# Altium schematic sheet DCTCXO.SchDoc: DCTCXO
size B; SheetNumber: 7; SheetTotal: 8
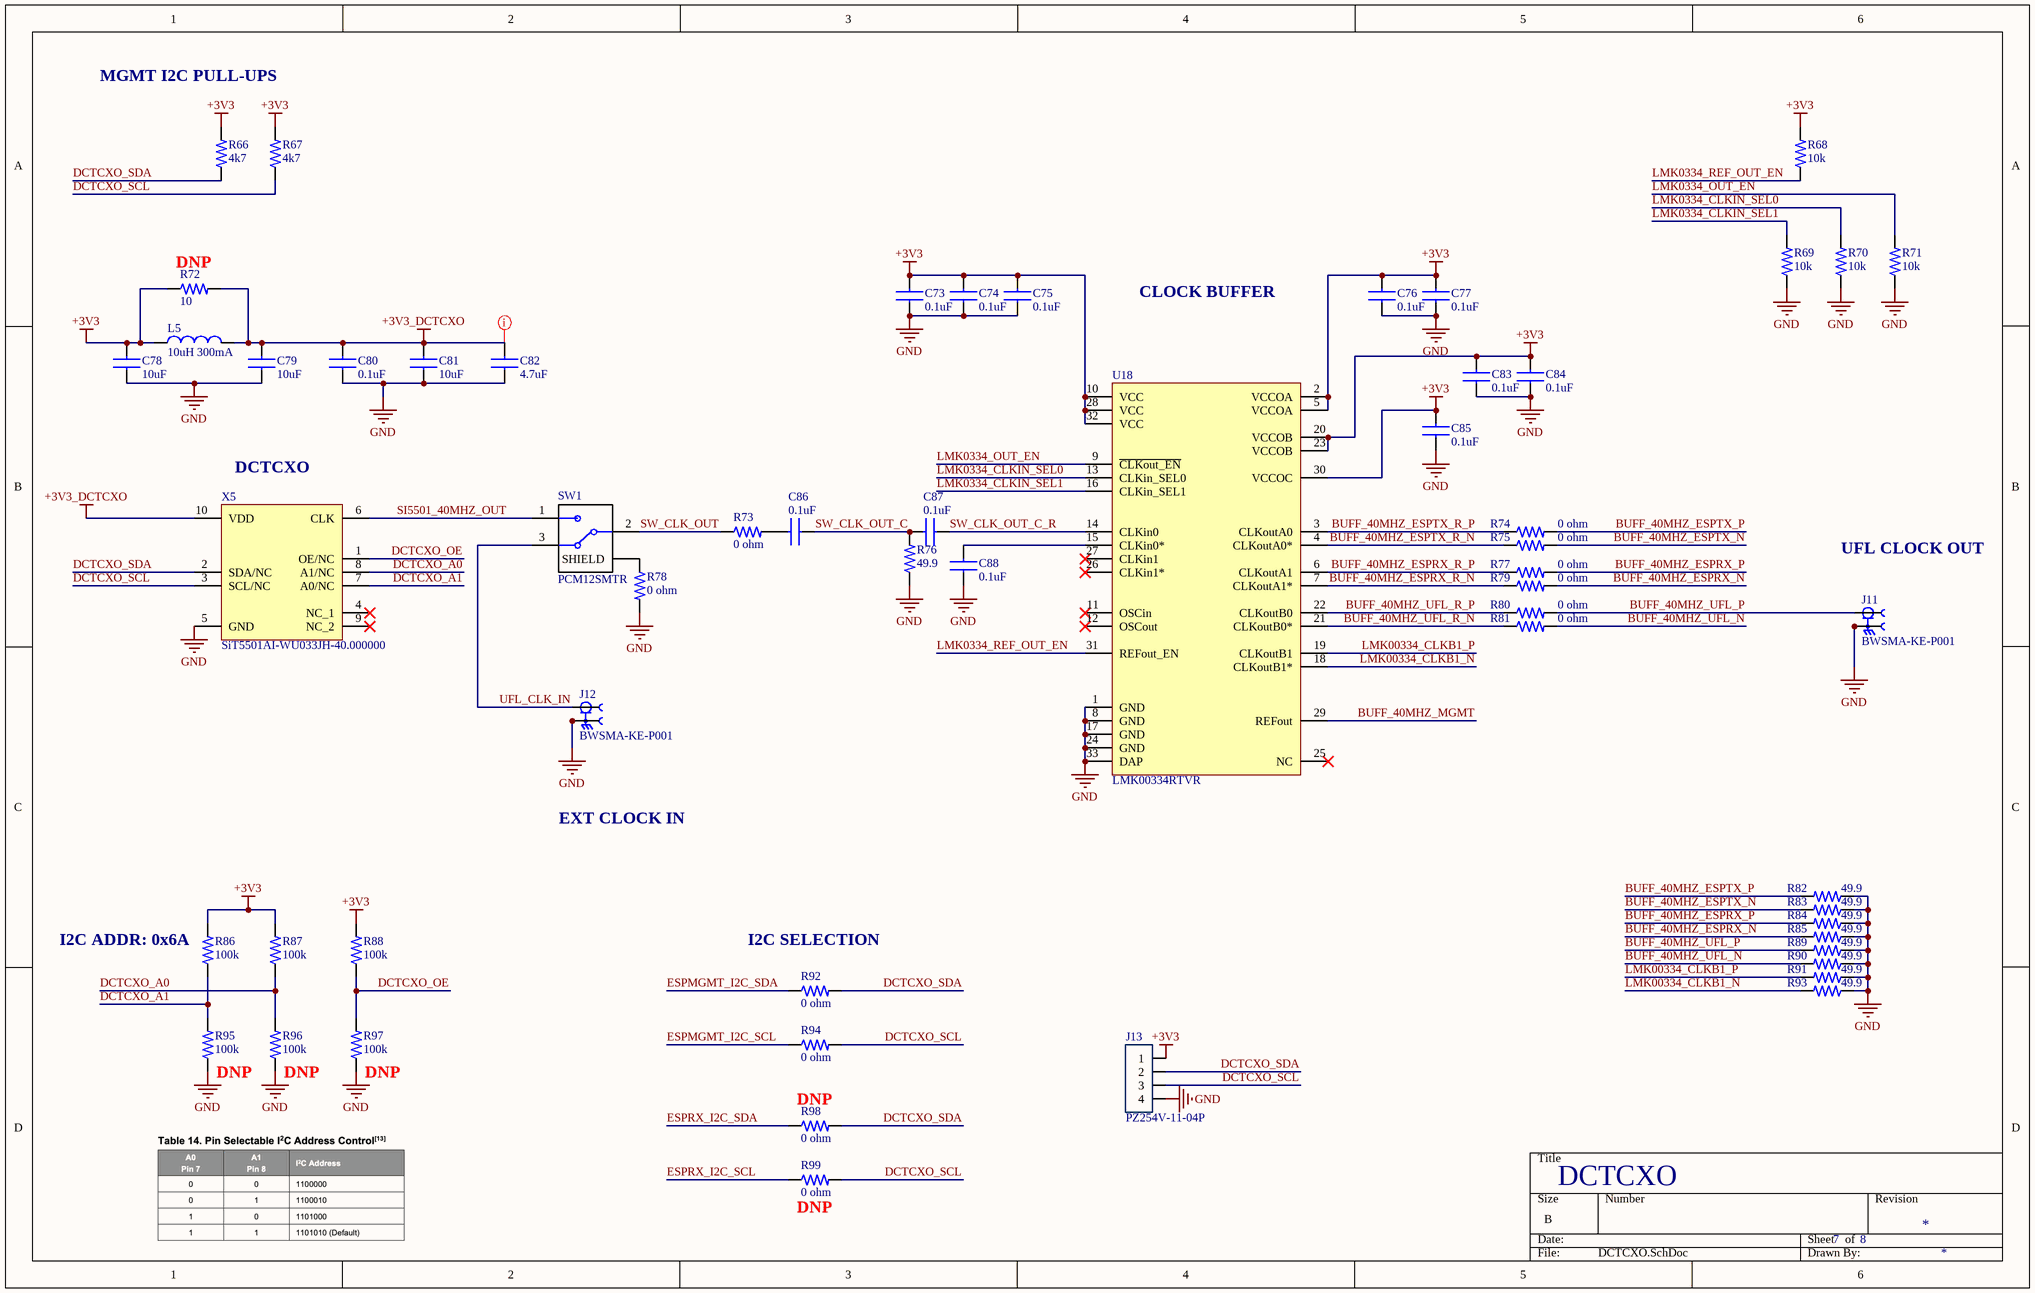
[diagram p0: DCTCXO.SchDoc]

## Parts
C73  0.1uF  [CAP_0402]
C74  0.1uF  [CAP_0402]
C75  0.1uF  [CAP_0402]
C76  0.1uF  [CAP_0402]
C77  0.1uF  [CAP_0402]
C78  10uF  [CAP_0402]
C79  10uF  [CAP_0402]
C80  0.1uF  [CAP_0402]
C81  10uF  [CAP_0402]
C82  4.7uF  [CAP_0402]
C83  0.1uF  [CAP_0402]
C84  0.1uF  [CAP_0402]
C85  0.1uF  [CAP_0402]
C86  0.1uF  [CAP_0402]
C87  0.1uF  [CAP_0402]
C88  0.1uF  [CAP_0402]
J11  BWSMA-KE-P001  [CONN_BWSMA-KE-P001]
J12  BWSMA-KE-P001  [CONN_BWSMA-KE-P001]
J13  PZ254V-11-04P  [CONN_4_PIN_M_100MIL]
L5  10uH 300mA  [L_490-LQM18DN100M70LCT-ND]
R66  4k7  [RES_0402]
R67  4k7  [RES_0402]
R68  10k  [RES_0402]
R69  10k  [RES_0402]
R70  10k  [RES_0402]
R71  10k  [RES_0402]
R72  10  [RES_0402]  (no BOM)
R73  0 ohm  [RES_0402]
R74  0 ohm  [RES_0402]
R75  0 ohm  [RES_0402]
R76  49.9  [RES_0402]
R77  0 ohm  [RES_0402]
R78  0 ohm  [RES_0402]
R79  0 ohm  [RES_0402]
R80  0 ohm  [RES_0402]
R81  0 ohm  [RES_0402]
R82  49.9  [RES_0402]
R83  49.9  [RES_0402]
R84  49.9  [RES_0402]
R85  49.9  [RES_0402]
R86  100k  [RES_0402]
R87  100k  [RES_0402]
R88  100k  [RES_0402]
R89  49.9  [RES_0402]
R90  49.9  [RES_0402]
R91  49.9  [RES_0402]
R92  0 ohm  [RES_0402]
R93  49.9  [RES_0402]
R94  0 ohm  [RES_0402]
R95  100k  [RES_0402]  (no BOM)
R96  100k  [RES_0402]  (no BOM)
R97  100k  [RES_0402]  (no BOM)
R98  0 ohm  [RES_0402]  (no BOM)
R99  0 ohm  [RES_0402]  (no BOM)
SW1  PCM12SMTR  [SW_PCM12SMTR]
U18  LMK00334RTVR  [IC_LMK00334RTVR]
X5  SiT5501AI-WU033JH-40.000000  [XTAL_SiT5501_70x50]

## Nets
+3V3: C73.2 C74.2 C75.2 C76.2 C77.2 C78.2 C83.2 C84.2 C85.2 J13.1 L5.1 R66.2 R67.2 R68.2 R72.1 R86.2 R87.2 R88.2 U18.2(VCCOA) U18.5(VCCOA) U18.10(VCC) U18.20(VCCOB) U18.23(VCCOB) U18.28(VCC) U18.30(VCCOC) U18.32(VCC)
+3V3_DCTCXO: C79.2 C80.2 C81.2 C82.2 L5.2 R72.2 X5.10(VDD)
GND: C73.1 C74.1 C75.1 C76.1 C77.1 C78.1 C79.1 C80.1 C81.1 C82.1 C83.1 C84.1 C85.1 C88.2 J11.2 J11.3 J11.4 J11.5 J12.2 J12.3 J12.4 J12.5 J13.4 R69.1 R70.1 R71.1 R76.1 R78.2 R82.1 R83.1 R84.1 R85.1 R89.1 R90.1 R91.1 R93.1 R95.1 R96.1 R97.1 U18.1(GND) U18.8(GND) U18.17(GND) U18.24(GND) U18.33(DAP) X5.5(GND)
BUFF_40MHZ_ESPRX_N: R79.2 R85.2
BUFF_40MHZ_ESPRX_P: R77.2 R84.2
BUFF_40MHZ_ESPRX_R_N: R79.1 U18.7(CLKoutA1*)
BUFF_40MHZ_ESPRX_R_P: R77.1 U18.6(CLKoutA1)
BUFF_40MHZ_ESPTX_N: R75.2 R83.2
BUFF_40MHZ_ESPTX_P: R74.2 R82.2
BUFF_40MHZ_ESPTX_R_N: R75.1 U18.4(CLKoutA0*)
BUFF_40MHZ_ESPTX_R_P: R74.1 U18.3(CLKoutA0)
BUFF_40MHZ_MGMT: U18.29(REFout)
BUFF_40MHZ_UFL_N: R81.2 R90.2
BUFF_40MHZ_UFL_P: J11.1 R80.2 R89.2
BUFF_40MHZ_UFL_R_N: R81.1 U18.21(CLKoutB0*)
BUFF_40MHZ_UFL_R_P: R80.1 U18.22(CLKoutB0)
DCTCXO_A0: R87.1 R96.2 X5.8(A1/NC)
DCTCXO_A1: R86.1 R95.2 X5.7(A0/NC)
DCTCXO_OE: R88.1 R97.2 X5.1(OE/NC)
DCTCXO_SCL: J13.3 R67.1 R94.2 R99.2 X5.3(SCL/NC)
DCTCXO_SDA: J13.2 R66.1 R92.2 R98.2 X5.2(SDA/NC)
ESPMGMT_I2C_SCL: R94.1
ESPMGMT_I2C_SDA: R92.1
ESPRX_I2C_SCL: R99.1
ESPRX_I2C_SDA: R98.1
LMK00334_CLKB1_N: R93.2 U18.18(CLKoutB1*)
LMK00334_CLKB1_P: R91.2 U18.19(CLKoutB1)
LMK0334_CLKIN_SEL0: R70.2 U18.13(CLKin_SEL0)
LMK0334_CLKIN_SEL1: R69.2 U18.16(CLKin_SEL1)
LMK0334_OUT_EN: R71.2 U18.9(~{CLKout_EN})
LMK0334_REF_OUT_EN: R68.1 U18.31(REFout_EN)
SI5501_40MHZ_OUT: SW1.1 X5.6(CLK)
SW_CLK_OUT: R73.1 SW1.2
SW_CLK_OUT_C: C86.1 C87.2 R76.2
SW_CLK_OUT_C_R: C87.1 U18.14(CLKin0)
UFL_CLK_IN: J12.1 SW1.3
NetC86_2: C86.2 R73.2
NetC88_1: C88.1 U18.15(CLKin0*)
NetR78_1: R78.1 SW1.S4(SHIELD)

Not connected (* = marked no-connect by the designer): U18 11(OSCin)* 12(OSCout)* 25(NC)* 26(CLKin1*)* 27(CLKin1)*; X5 4(NC_1)* 9(NC_2)*

## Layout directives
net class Power: +3V3_DCTCXO

## Notes on the sheet
- MGMT I2C PULL-UPS
- (near R72) DNP
- CLOCK BUFFER
- (near X5) DCTCXO
- UFL CLOCK OUT
- EXT CLOCK IN
- (near R86) I2C ADDR: 0x6A
- (near R92) I2C SELECTION
- (near R95) DNP
- (near R96) DNP
- (near R97) DNP
- (near R98) DNP
- (near R99) DNP

## Library data of the parts
C73-C77 C80 C83-C88 = CAP_GCM155R71C104KA55J: Cap Ceramic 0.1uF 16V X7R 10% SMD 0402 125C Paper T/R; Manufacturer: Murata; Capacitance: 100nF; Supplier 1: Digi-Key; Manufacturer Part Number: GCM155R71C104KA55J; RoHS: Yes; Category: Ceramic Capacitors; Stock 1: 10738061; Pricing 1: 1=0.10000, 10=0.03500, 50=0.01920, 100=0.01560, 500=0.01116, 1000=0.00877, 2500=0.00798, 5000=0.00734 (USD); Mount: Surface Mount; Case/Package: 0402; Case Code (Imperial): 0402; Case Code (Metric): 1005; Min Operating Temperature: -55°C; Max Operating Temperature: 125°C; Tolerance: 10%; Voltage Rating: 16V; Voltage Rating (DC): 16V; Packaging: Tape and Reel; Package Quantity: 1; Dielectric: X7R; Termination: SMD/SMT; Series: GCM; Construction: Flat; Length: 1mm; Width: 0.5mm; Height: 0.5mm; Thickness: 0.022inch; Depth: 0.5mm; Ratings: AEC-Q200; Radiation Hardening: No; Lead Free: Lead Free; ComponentLink1URL: https://datasheet.ciiva.com/11618/product-11618848.pdf?src-supplier=Avnet; ComponentLink1Description: https://datasheet.ciiva.com/11618/product-11618848.pdf?src-supplier=Avnet; ComponentLink2URL: https://datasheet.ciiva.com/16440/gcm155r71c104ka55j-16440393.pdf?src-supplier=Future+Electronics; ComponentLink2Description: https://datasheet.ciiva.com/16440/gcm155r71c104ka55j-16440393.pdf?src-supplier=Future+Electronics; ComponentLink3URL: https://datasheet.ciiva.com/29542/product-29542474.pdf?src-supplier=Digi-Key; ComponentLink3Description: https://datasheet.ciiva.com/29542/product-29542474.pdf?src-supplier=Digi-Key; ComponentLink4URL: https://datasheet.ciiva.com/29542/product-29542475.pdf?src-supplier=Digi-Key; ComponentLink4Description: https://datasheet.ciiva.com/29542/product-29542475.pdf?src-supplier=Digi-Key; Supplier Part Number 1: 490-7998-1-ND
C78 C79 C81 = CAP_CL05A106MQ5NUNC: Cap Ceramic 10uF 6.3V X5R 20% SMD 0402 85°C Paper T/R; Manufacturer: Samsung; Supplier 1: Digi-Key; Manufacturer Part Number: CL05A106MQ5NUNC; RoHS: Yes; Category: Ceramic Capacitors; Stock 1: 3345553; Pricing 1: 1=0.27000, 10=0.18400, 50=0.11020, 100=0.09300, 500=0.06362, 1000=0.05629, 2500=0.05384, 5000=0.04894 (USD); Mount: Surface Mount; Case/Package: 0402; Case Code (Metric): 1005; Case Code (Imperial): 0402; Min Operating Temperature: -55°C; Max Operating Temperature: 85°C; Tolerance: 20%; Capacitance: 10uF; Dielectric: X5R; Packaging: Tape and Reel; Package Quantity: 1; Voltage Rating: 6.3V; Series: CL; Construction: Flat; Length: 1mm; Width: 0.02inch; Height: 0.5mm; Thickness: 0.028inch; Depth: 0.5mm; Radiation Hardening: No; ComponentLink1URL: https://datasheet.ciiva.com/16437/cl05a106mq5nunc-16437356.pdf?src-supplier=Future+Electronics; ComponentLink1Description: https://datasheet.ciiva.com/16437/cl05a106mq5nunc-16437356.pdf?src-supplier=Future+Electronics; ComponentLink2URL: https://datasheet.ciiva.com/26877/getdatasheetpartid-355289-26877841.pdf?src-supplier=Verical; ComponentLink2Description: https://datasheet.ciiva.com/26877/getdatasheetpartid-355289-26877841.pdf?src-supplier=Verical; Supplier Part Number 1: 1276-1451-1-ND
C82 = CAP_LMK105BBJ475MVLF: Multilayer Ceramic Capacitors MLCC - SMD/SMT 4.7uF 10V X5R +/-20% 0402 Gen Purp; Manufacturer: Taiyo Yuden; Tolerance: 20%; Supplier 1: Digi-Key; Manufacturer Part Number: LMK105BBJ475MVLF; RoHS: Yes; Category: Ceramic Capacitors; Pricing 1: 1=0.21000, 10=0.14400, 50=0.08640, 100=0.07300, 500=0.04994, 1000=0.04417, 2500=0.04225, 5000=0.03841 (USD); Mount: Surface Mount; Case/Package: 0402; Case Code (Metric): 1005; Case Code (Imperial): 0402; Weight: 2.3E-05oz; Min Operating Temperature: -55°C; Max Operating Temperature: 85°C; Capacitance: 4.7uF; Package Quantity: 10000; Packaging: Tape and Reel; Voltage Rating: 10V; Voltage Rating (DC): 10V; Dielectric: X5R; Termination: SMD/SMT; Resistor Type: Ceramic; Length: 1mm; Width: 0.02inch; Height: 0.5mm; Thickness: 0.022inch; Halogen Free: Halogen Free; RoHS Compliant: Yes; ComponentLink1URL: https://datasheet.ciiva.com/24462/423lmk105bbj475mvlf-24462535.pdf?src-supplier=Onlinecomponents.com; ComponentLink1Description: https://datasheet.ciiva.com/24462/423lmk105bbj475mvlf-24462535.pdf?src-supplier=Onlinecomponents.com; ComponentLink2URL: https://datasheet.ciiva.com/18697/mlcc-all-e-18697686.pdf?src-supplier=Digi-Key; ComponentLink2Description: https://datasheet.ciiva.com/18697/mlcc-all-e-18697686.pdf?src-supplier=Digi-Key; ComponentLink3URL: https://datasheet.ciiva.com/18697/mlcc-all-e-18697685.pdf?src-supplier=Digi-Key; ComponentLink3Description: https://datasheet.ciiva.com/18697/mlcc-all-e-18697685.pdf?src-supplier=Digi-Key; Supplier Part Number 1: 587-3408-1-ND
J11 J12 = CONN_BWSMA-KE-P001: 0-12.4GHz 50Ω 335V 直插偏脚; Manufacturer: BAT Wireless; Supplier 1: LCSC; Manufacturer Part Number: BWSMA-KE-P001; RoHS: No; Stock 1: 21382; Pricing 1: 1=0.3453, 10=0.2721, 30=0.2355, 100=0.2037, 500=0.1957, 1000=0.1894 (USD); Supplier Part Number 1: C496550
J13 = CONN_4_PIN_MALE_PZ254V-11-04P: 单排排针 间距2.54mm 4pin 直插; Manufacturer: XFCN; Supplier 1: LCSC; Manufacturer Part Number: PZ254V-11-04P; RoHS: No; Stock 1: 101260; Pricing 1: 20=0.0196, 200=0.0157, 1000=0.0125, 2000=0.0112, 10000=0.01, 20000=0.0095 (USD); Supplier Part Number 1: C2691448
L5 = L_LQM18DN100M70L: Inductor, 10Uh, 0.3A, Multilayer Rohs Compliant: Yes; Manufacturer: Murata; Supplier 1: Digi-Key; Manufacturer Part Number: LQM18DN100M70L; RoHS: Yes; Category: Fixed Inductors; Stock 1: 236207; Pricing 1: 1=0.12000, 10=0.10500, 25=0.09280, 50=0.07900, 100=0.06970, 250=0.06388, 500=0.05808, 1000=0.04878 (USD); Supplier Part Number 1: 490-LQM18DN100M70LCT-ND
R66 R67 = RES_RC0402JR-074K7L: Res General Purpose Thick Film 0402 4.7K Ohm 5% 1/16W ±100ppm/°C Molded SMD Paper T/R; Manufacturer: Yageo; Voltage Rating: 50V; Value: 4.7kR; Power Rating: 62.5mW; Max Power Dissipation: 63mW; Supplier 1: Digi-Key; Manufacturer Part Number: RC0402JR-074K7L; RoHS: Yes; Category: Chip SMD Resistors; Stock 1: 26835683; Pricing 1: 1=0.10000, 10=0.01200, 100=0.00480, 1000=0.00214, 2500=0.00186, 5000=0.00154 (USD); Case/Package: 0402; Case Code (Imperial): 0402; Case Code (Metric): 1005; Min Operating Temperature: -55°C; Max Operating Temperature: 155°C; Tolerance: 5%; Packaging: Tape and Reel; Package Quantity: 1; Termination: SMD/SMT; Resistor Type: Thick Film; Number of Terminations: 2; Temperature Coefficient: 100ppm/°C; Features: Moisture Resistant; Series: RC; Resistance Tolerance: 5%; Construction: Rectangular; Length: 0.039inch; Width: 0.02inch; Height: 0.016inch; Depth: 0.5mm; Reach SVHC Compliant: Yes; Military Standard: Not; Lead Free: Lead Free; RoHS Compliant: Yes; Supplier Part Number 1: 311-4.7KJRCT-ND
R68-R71 = RES_AC0402FR-0710KL: RES SMD 10K OHM 1% 1/16W 0402; Manufacturer: Yageo; Resistance: 10kR; Power Rating: 62.5mW; Voltage Rating: 50V; Temperature Coefficient: 100ppm/°C; Max Power Dissipation: 63mW; Supplier 1: Digi-Key; Manufacturer Part Number: AC0402FR-0710KL; RoHS: Yes; Category: Chip SMD Resistors; Stock 1: 2860; Pricing 1: 1=0.10000, 10=0.02200, 100=0.00900, 1000=0.00402, 2500=0.00349, 5000=0.00288 (USD); Case/Package: 0402; Case Code (Imperial): 0402; Case Code (Metric): 1005; Size Code: 0402; Min Operating Temperature: -55°C; Max Operating Temperature: 155°C; Tolerance: 1%; Packaging: Tape and Reel; Resistor Type: Thick Film; Termination: SMD/SMT; Number of Terminations: 2; Features: Moisture Resistant,Automotive AEC-Q200; Series: AC; Construction: Rectangular; Length: 0.039inch; Width: 0.02inch; Height: 0.015inch; Depth: 0.5mm; Military Standard: Not; Lead Free: Lead Free; RoHS Compliant: Yes; ComponentLink1URL: https://datasheet.ciiva.com/12656/pyu-ac-51-rohs-l-2-12656634.pdf?src-supplier=Mouser; ComponentLink1Description: https://datasheet.ciiva.com/12656/pyu-ac-51-rohs-l-2-12656634.pdf?src-supplier=Mouser; Supplier Part Number 1: YAG3436CT-ND
R72 = RES_RC0402FR-0710RL: Res General Purpose Thick Film 0402 10 Ohm 1% 1/16W ±200ppm/°C Molded SMD Paper T/R; Manufacturer: Yageo; Power Rating: 62.5mW; Voltage Rating: 50V; Value: 10R; Max Power Dissipation: 63mW; Supplier 1: Digi-Key; Manufacturer Part Number: RC0402FR-0710RL; RoHS: Yes; Category: Chip SMD Resistors; Stock 1: 6576941; Pricing 1: 1=0.10000, 10=0.02200, 100=0.00880, 1000=0.00396, 2500=0.00344, 5000=0.00284 (USD); Case/Package: 0402; Case Code (Imperial): 0402; Case Code (Metric): 1005; Min Operating Temperature: -55°C; Max Operating Temperature: 155°C; Tolerance: 1%; Packaging: Tape and Reel; Termination: SMD/SMT; Resistor Type: Thick Film; Temperature Coefficient: 200ppm/°C; Number of Terminations: 2; Features: Moisture Resistant; Series: RC; Resistance Tolerance: 1%; Technology: THICK FILM; Construction: Rectangular; Working Voltage: 50V; Length: 1mm; Height: 0.32mm; Depth: 0.5mm; Military Standard: Not; Lead Free: Lead Free; RoHS Compliant: Yes; Reach SVHC Compliant: Yes; ComponentLink1URL: https://datasheet.ciiva.com/46394/1018594-46394954.pdf?src-supplier=Element14; ComponentLink1Description: https://datasheet.ciiva.com/46394/1018594-46394954.pdf?src-supplier=Element14; ComponentLink2URL: https://datasheet.ciiva.com/7849/1018594-7849818.pdf?src-supplier=Element14; ComponentLink2Description: https://datasheet.ciiva.com/7849/1018594-7849818.pdf?src-supplier=Element14; ComponentLink3URL: https://datasheet.ciiva.com/7849/1018594-7849819.pdf?src-supplier=Element14; ComponentLink3Description: https://datasheet.ciiva.com/7849/1018594-7849819.pdf?src-supplier=Element14; ComponentLink4URL: https://datasheet.ciiva.com/15189/getdatasheetpartid-323697-15189339.pdf?src-supplier=Verical; ComponentLink4Description: https://datasheet.ciiva.com/15189/getdatasheetpartid-323697-15189339.pdf?src-supplier=Verical; Supplier Part Number 1: 311-10.0LRCT-ND
R73-R75 R77-R81 R92 R94 R98 R99 = RES_RC0402JR-070RL: RES SMD 0 OHM JUMPER 1/16W 0402; Manufacturer: Yageo; Value: 0mR; Power Rating: 62.5mW; Tolerance: 5%; Voltage Rating: 50V; Max Power Dissipation: 63mW; Temperature Coefficient: 200ppm/°C; Supplier 1: Digi-Key; Manufacturer Part Number: RC0402JR-070RL; RoHS: Yes; Category: Chip SMD Resistors; Stock 1: 33185339; Pricing 1: 1=0.10000, 10=0.01200, 25=0.00840, 50=0.00640, 100=0.00480, 250=0.00364, 500=0.00290, 1000=0.00214, 5000=0.00154 (USD); Case/Package: 0402; Case Code (Metric): 1005; Case Code (Imperial): 0402; Contact Plating: Tin,Matte; Min Operating Temperature: -55°C; Max Operating Temperature: 155°C; Package Quantity: 1; Packaging: Tape and Reel; Resistor Type: Thick Film; Number of Terminations: 2; Termination: SMD/SMT; Features: Moisture Resistant; Series: RC; Technology: THICK FILM; Resistance Tolerance: 5%; Construction: Rectangular; Length: 1mm; Width: 0.02inch; Height: 0.016inch; Depth: 0.5mm; Radiation Hardening: No; Military Standard: Not; Lead Free: Lead Free; RoHS Compliant: Yes; ComponentLink1URL: https://datasheet.ciiva.com/2452/pyu-rc0402-51-rohs-l-6-2452608.pdf?src-supplier=Digi-Key; ComponentLink1Description: https://datasheet.ciiva.com/2452/pyu-rc0402-51-rohs-l-6-2452608.pdf?src-supplier=Digi-Key; ComponentLink2URL: https://datasheet.ciiva.com/7983/1018594-7983535.pdf?src-supplier=Element14; ComponentLink2Description: https://datasheet.ciiva.com/7983/1018594-7983535.pdf?src-supplier=Element14; ComponentLink3URL: https://datasheet.ciiva.com/22747/1018594-22747515.pdf?src-supplier=Element14; ComponentLink3Description: https://datasheet.ciiva.com/22747/1018594-22747515.pdf?src-supplier=Element14; ComponentLink4URL: https://datasheet.ciiva.com/2452/pyu-r-int-thick-7-2452609.pdf?src-supplier=Digi-Key; ComponentLink4Description: https://datasheet.ciiva.com/2452/pyu-r-int-thick-7-2452609.pdf?src-supplier=Digi-Key; ComponentLink5URL: https://datasheet.ciiva.com/2452/pyu-r-int-thick-7-2452610.pdf?src-supplier=Digi-Key; ComponentLink5Description: https://datasheet.ciiva.com/2452/pyu-r-int-thick-7-2452610.pdf?src-supplier=Digi-Key; ComponentLink6URL: https://datasheet.ciiva.com/8896/pyu-rc0402-51-rohs-l-6-8896201.pdf?src-supplier=Avnet; ComponentLink6Description: https://datasheet.ciiva.com/8896/pyu-rc0402-51-rohs-l-6-8896201.pdf?src-supplier=Avnet; ComponentLink7URL: https://datasheet.ciiva.com/15189/getdatasheetpartid-326379-15189533.pdf?src-supplier=Verical; ComponentLink7Description: https://datasheet.ciiva.com/15189/getdatasheetpartid-326379-15189533.pdf?src-supplier=Verical; Supplier Part Number 1: 311-0.0JRCT-ND
R76 R82-R85 R89-R91 R93 = RES_RC0402FR-0749R9L: Res General Purpose Thick Film 0402 49.9 Ohm 1% 1/16W ±100ppm/°C Molded SMD Paper T/R; Manufacturer: Yageo; Voltage Rating (DC): 50V; Value: 49.9R; Power Rating: 62.5mW; Max Power Dissipation: 63mW; Supplier 1: Digi-Key; Manufacturer Part Number: RC0402FR-0749R9L; RoHS: Yes; Category: Chip SMD Resistors; Stock 1: 11146612; Pricing 1: 1=0.10000, 10=0.01400, 100=0.00580, 1000=0.00262, 2500=0.00228, 5000=0.00188 (USD); Case/Package: 0402; Pins: 2; Case Code (Imperial): 0402; Case Code (Metric): 1005; Min Operating Temperature: -55°C; Max Operating Temperature: 155°C; Packaging: Tape and Reel; Tolerance: 1%; Package Quantity: 1; Features: Moisture Resistant; Series: RC; Voltage Rating: 50V; Termination: SMD/SMT; Resistor Type: Thick Film; Number of Terminations: 2; Temperature Coefficient: 100ppm/°C; Construction: Rectangular; Resistance Tolerance: 1%; Working Voltage: 50V; Technology: THICK FILM; Length: 1mm; Width: 0.02inch; Height: 0.016inch; Depth: 0.5mm; Lead Free: Lead Free; Reach SVHC Compliant: Yes; Military Standard: Not; RoHS Compliant: Yes; ComponentLink1URL: https://datasheet.ciiva.com/7983/1018594-7983542.pdf?src-supplier=Element14; ComponentLink1Description: https://datasheet.ciiva.com/7983/1018594-7983542.pdf?src-supplier=Element14; ComponentLink2URL: https://datasheet.ciiva.com/22747/1018594-22747514.pdf?src-supplier=Element14; ComponentLink2Description: https://datasheet.ciiva.com/22747/1018594-22747514.pdf?src-supplier=Element14; ComponentLink3URL: https://datasheet.ciiva.com/2453/pyu-r-int-thick-7-2453356.pdf?src-supplier=Digi-Key; ComponentLink3Description: https://datasheet.ciiva.com/2453/pyu-r-int-thick-7-2453356.pdf?src-supplier=Digi-Key; ComponentLink4URL: https://datasheet.ciiva.com/2453/pyu-r-int-thick-7-2453357.pdf?src-supplier=Digi-Key; ComponentLink4Description: https://datasheet.ciiva.com/2453/pyu-r-int-thick-7-2453357.pdf?src-supplier=Digi-Key; ComponentLink5URL: https://datasheet.ciiva.com/2453/pyu-r-int-thick-7-2453355.pdf?src-supplier=Digi-Key; ComponentLink5Description: https://datasheet.ciiva.com/2453/pyu-r-int-thick-7-2453355.pdf?src-supplier=Digi-Key; ComponentLink6URL: https://datasheet.ciiva.com/16743/pyu-rc0402-51-rohs-l-6-r-16743942.pdf?src-supplier=Future+Electronics; ComponentLink6Description: https://datasheet.ciiva.com/16743/pyu-rc0402-51-rohs-l-6-r-16743942.pdf?src-supplier=Future+Electronics; Supplier Part Number 1: 311-49.9LRCT-ND
R86-R88 R95-R97 = RES_CRCW0402100KFKED: Res Thick Film 0402 100K Ohm 1% 1/16W ±100ppm/°C Molded SMD Paper T/R; Manufacturer: Vishay; Resistance: 100kR; Power Rating: 63mW; Voltage Rating: 50V; Supplier 1: Newark; Manufacturer Part Number: CRCW0402100KFKED; RoHS: Yes; Category: Chip SMD Resistors; Stock 1: 3660000; Pricing 1: 1=0.00600, 10000=0.00600 (USD); Mount: Surface Mount; Case/Package: 0402; Number of Pins: 2; Contact Plating: Tin; Weight: 2.3E-05oz; Case Code (Metric): 1005; Case Code (Imperial): 0402; Size Code: 0402; Min Operating Temperature: -55°C; Max Operating Temperature: 155°C; Tolerance: 1%; Resistor Type: Thick Film; Temperature Coefficient: 100ppm/°C; Termination: SMD/SMT; Packaging: Tape and Reel; Package Quantity: 10000; Number of Terminations: 2; Max Power Dissipation: 63mW; Voltage Rating (DC): 50V; Features: Automotive AEC-Q200; Series: CRCW; Technology: THICK FILM; Resistance Tolerance: 1%; Construction: Rectangular; Length: 1mm; Width: 0.02inch; Height: 0.35mm; Depth: 0.5mm; Radiation Hardening: No; Lead Free: Lead Free; RoHS Compliant: Yes; REACH SVHC: Unknown; Military Standard: Not; ComponentLink1URL: https://datasheet.ciiva.com/11810/0900766b80d98824-11810752.pdf?src-supplier=RSComponents; ComponentLink1Description: https://datasheet.ciiva.com/11810/0900766b80d98824-11810752.pdf?src-supplier=RSComponents; ComponentLink2URL: https://datasheet.ciiva.com/2463/dcrcwe3-2463064.pdf?src-supplier=Digi-Key; ComponentLink2Description: https://datasheet.ciiva.com/2463/dcrcwe3-2463064.pdf?src-supplier=Digi-Key; ComponentLink3URL: https://datasheet.ciiva.com/2463/dcrcwe3-2463065.pdf?src-supplier=Digi-Key; ComponentLink3Description: https://datasheet.ciiva.com/2463/dcrcwe3-2463065.pdf?src-supplier=Digi-Key; ComponentLink4URL: https://datasheet.ciiva.com/2463/dcrcwe3-2463066.pdf?src-supplier=Digi-Key; ComponentLink4Description: https://datasheet.ciiva.com/2463/dcrcwe3-2463066.pdf?src-supplier=Digi-Key; ComponentLink5URL: https://datasheet.ciiva.com/3255/dcrcwe3-3255947.pdf?src-supplier=Avnet; ComponentLink5Description: https://datasheet.ciiva.com/3255/dcrcwe3-3255947.pdf?src-supplier=Avnet; ComponentLink6URL: https://datasheet.ciiva.com/3255/dcrcwe3-3255948.pdf?src-supplier=Avnet; ComponentLink6Description: https://datasheet.ciiva.com/3255/dcrcwe3-3255948.pdf?src-supplier=Avnet; ComponentLink7URL: https://datasheet.ciiva.com/5546/dcrcwe3-109170-5546638.pdf?src-supplier=Mouser; ComponentLink7Description: https://datasheet.ciiva.com/5546/dcrcwe3-109170-5546638.pdf?src-supplier=Mouser; ComponentLink8URL: https://datasheet.ciiva.com/26316/fld-crcw-e3-data-en-26316630.pdf?src-supplier=Distrelec; ComponentLink8Description: https://datasheet.ciiva.com/26316/fld-crcw-e3-data-en-26316630.pdf?src-supplier=Distrelec; ComponentLink9URL: https://datasheet.ciiva.com/16941/dcrcwe3-16941129.pdf?src-supplier=Avnet+Europe; ComponentLink9Description: https://datasheet.ciiva.com/16941/dcrcwe3-16941129.pdf?src-supplier=Avnet+Europe; ComponentLink10URL: https://datasheet.ciiva.com/16208/dcrcwe3-16208508.pdf?src-supplier=Future+Electronics; ComponentLink10Description: https://datasheet.ciiva.com/16208/dcrcwe3-16208508.pdf?src-supplier=Future+Electronics; ComponentLink11URL: https://datasheet.ciiva.com/46441/1720486-46441598.pdf?src-supplier=Element14; ComponentLink11Description: https://datasheet.ciiva.com/46441/1720486-46441598.pdf?src-supplier=Element14; ComponentLink12URL: https://datasheet.ciiva.com/16776/70201119-16776281.pdf?src-supplier=Allied+Electronics; ComponentLink12Description: https://datasheet.ciiva.com/16776/70201119-16776281.pdf?src-supplier=Allied+Electronics; Supplier Part Number 1: 24W1923
SW1 = SW_PCM12SMTR: Slide Switch SPDT Surface Mount, Right Angle; MF: C&K; Package: DO-201 C&amp;K Components; Digi-Key_Part_Number: 401-2016-1-ND; Digi-Key_Purchase_URL: https://www.digikey.com/product-detail/en/c-k/PCM12SMTR/401-2016-1-ND/1640125?utm_source=snapeda&utm_medium=aggregator&utm_campaign=symbol; Value: *; SnapEDA_Link: https://www.snapeda.com/parts/PCM12SMTR/C&K/view-part/229977/?ref=snap; MP: PCM12SMTR
U18 = IC_LMK00334RTVR: 4-output PCIe Gen1/Gen2/Gen3/Gen4 clock buffer and level translator 32-WQFN -40 to 85; Manufacturer: Texas Instruments; Number of Outputs: 4; Number of Circuits: 1; Clock Frequency: 400MHz; Input: Crystal; PLL: No; Min Supply Voltage: 3.15V; Max Supply Voltage: 3.45V; Operating Supply Current: 13.5mA; Propagation Delay: 2700ps; Max Duty Cycle: 55%; Operating Supply Voltage: 3.3V; Supply Current: 8.5mA; Supplier 1: LCSC; Manufacturer Part Number: LMK00334RTVR; RoHS: Yes; Category: Clock Buffers, Drivers; Stock 1: 1001; Pricing 1: 1=2.0539, 10=1.7676, 30=1.5894, 100=1.3841, 500=1.3014, 1000=1.2648 (USD); Mounting Technology: Surface Mount; Pins: 32; Min Operating Temperature: -40°C; Max Operating Temperature: 85°C; Packaging: Tape and Reel; Series: -; Frequency: 400MHz; Package Quantity: 1000; Radiation Hardening: No; RoHS Compliant: Yes; Reach SVHC Compliant: No; Lead Free: Lead Free; ComponentLink1URL: https://datasheet.ciiva.com/28657/1789733-28657440.pdf?src-supplier=Element14; ComponentLink1Description: https://datasheet.ciiva.com/28657/1789733-28657440.pdf?src-supplier=Element14; ComponentLink2URL: https://datasheet.ciiva.com/29661/lmk00334-29661008.pdf?src-supplier=Digi-Key; ComponentLink2Description: https://datasheet.ciiva.com/29661/lmk00334-29661008.pdf?src-supplier=Digi-Key; Supplier Part Number 1: C201644
X5 = XTAL_SIT5501AI-WUG33JT-10.000000: 1 MHz  60 MHz, Elite X Stratum 3E Precision Oscillator; Manufacturer_Name: SiTime; Geometry.Height: 2.2mm; Manufacturer_Part_Number: SiT5501AI-WU033JH-40.000000; Mouser Part Number: *; Mouser Price/Stock: *; Arrow Part Number: *; Arrow Price/Stock: *; Mouser Testing Part Number: *; Mouser Testing Price/Stock: *; Datasheet Link: https://www.sitime.com/support/resource-library/datasheets/sit5501-datasheet